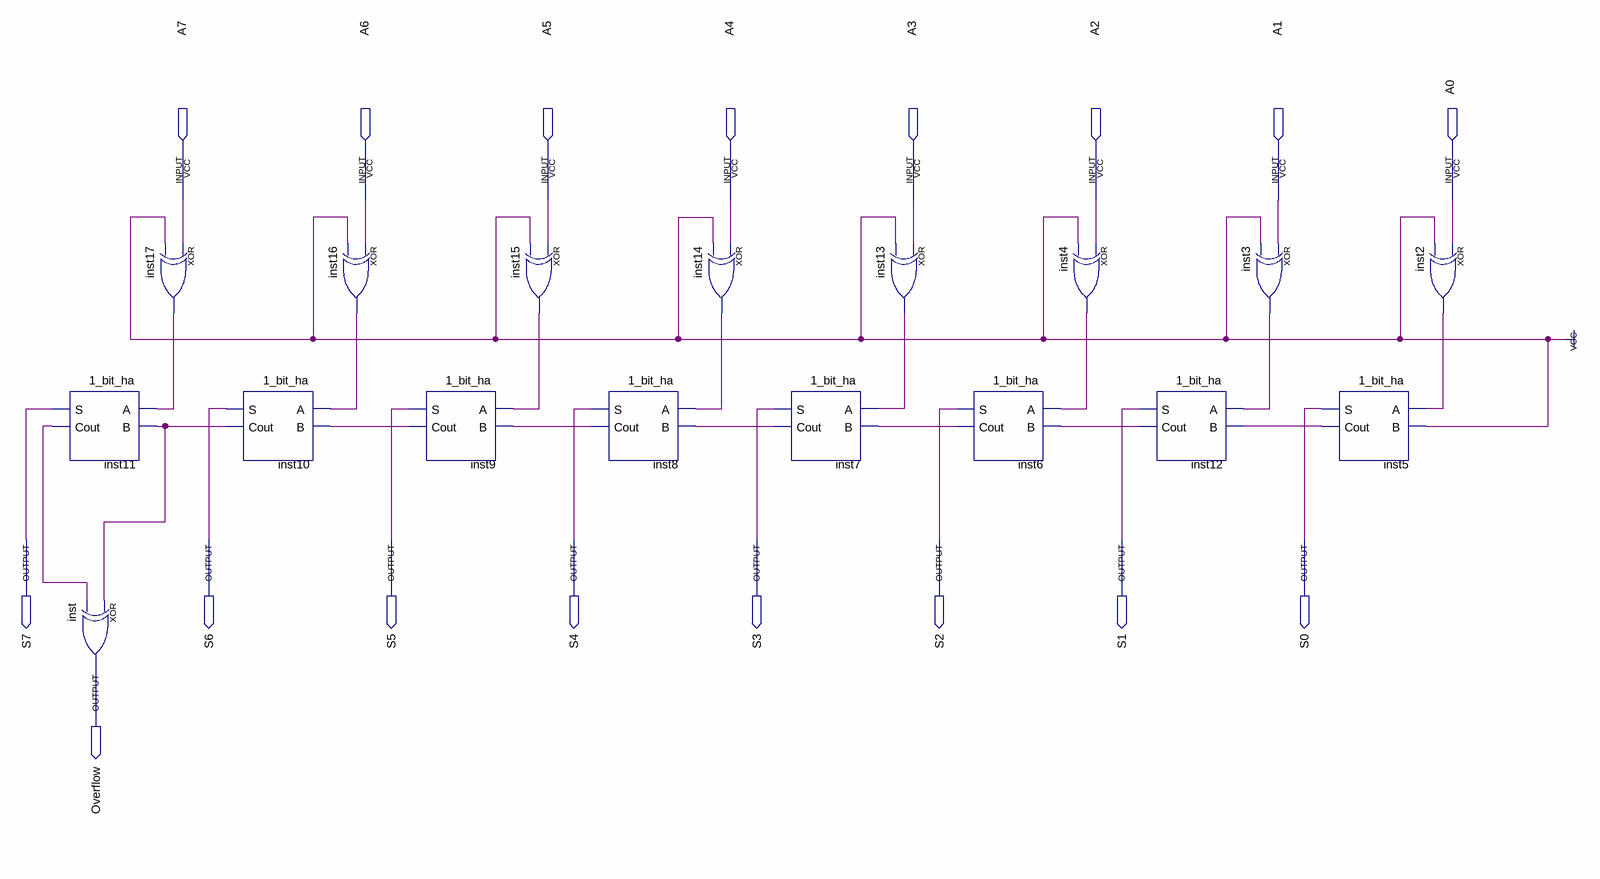
[diagram p0: schematic sheet]
// Quartus schematic twos_complementer.bdf as structural Verilog: 17 symbols, 17 pins
module twos_complementer (
  input  A7,
  input  A6,
  input  A5,
  input  A4,
  input  A3,
  input  A2,
  input  A1,
  input  A0,
  output S7,
  output S6,
  output S5,
  output S4,
  output S3,
  output S2,
  output S1,
  output S0,
  output Overflow
);

  wire inst2_out, inst3_out, inst4_out, inst5_cout, inst6_cout, inst7_cout, inst8_cout, inst9_cout,
       inst10_cout, inst11_cout, inst12_cout, inst13_out, inst14_out, inst15_out, inst16_out, inst17_out;

  \1_bit_ha  inst11 (.A(inst17_out), .B(inst10_cout), .S(S7), .Cout(inst11_cout));
  xor inst (Overflow, inst10_cout, inst11_cout);
  xor inst17 (inst17_out, A7, 1'b1);
  \1_bit_ha  inst10 (.A(inst16_out), .B(inst9_cout), .S(S6), .Cout(inst10_cout));
  xor inst16 (inst16_out, A6, 1'b1);
  \1_bit_ha  inst9 (.A(inst15_out), .B(inst8_cout), .S(S5), .Cout(inst9_cout));
  xor inst15 (inst15_out, A5, 1'b1);
  \1_bit_ha  inst8 (.A(inst14_out), .B(inst7_cout), .S(S4), .Cout(inst8_cout));
  xor inst14 (inst14_out, A4, 1'b1);
  \1_bit_ha  inst7 (.A(inst13_out), .B(inst6_cout), .S(S3), .Cout(inst7_cout));
  xor inst13 (inst13_out, A3, 1'b1);
  \1_bit_ha  inst6 (.A(inst4_out), .B(inst12_cout), .S(S2), .Cout(inst6_cout));
  xor inst4 (inst4_out, A2, 1'b1);
  \1_bit_ha  inst12 (.A(inst3_out), .B(inst5_cout), .S(S1), .Cout(inst12_cout));
  xor inst3 (inst3_out, A1, 1'b1);
  \1_bit_ha  inst5 (.A(inst2_out), .B(1'b1), .S(S0), .Cout(inst5_cout));
  xor inst2 (inst2_out, A0, 1'b1);
endmodule
